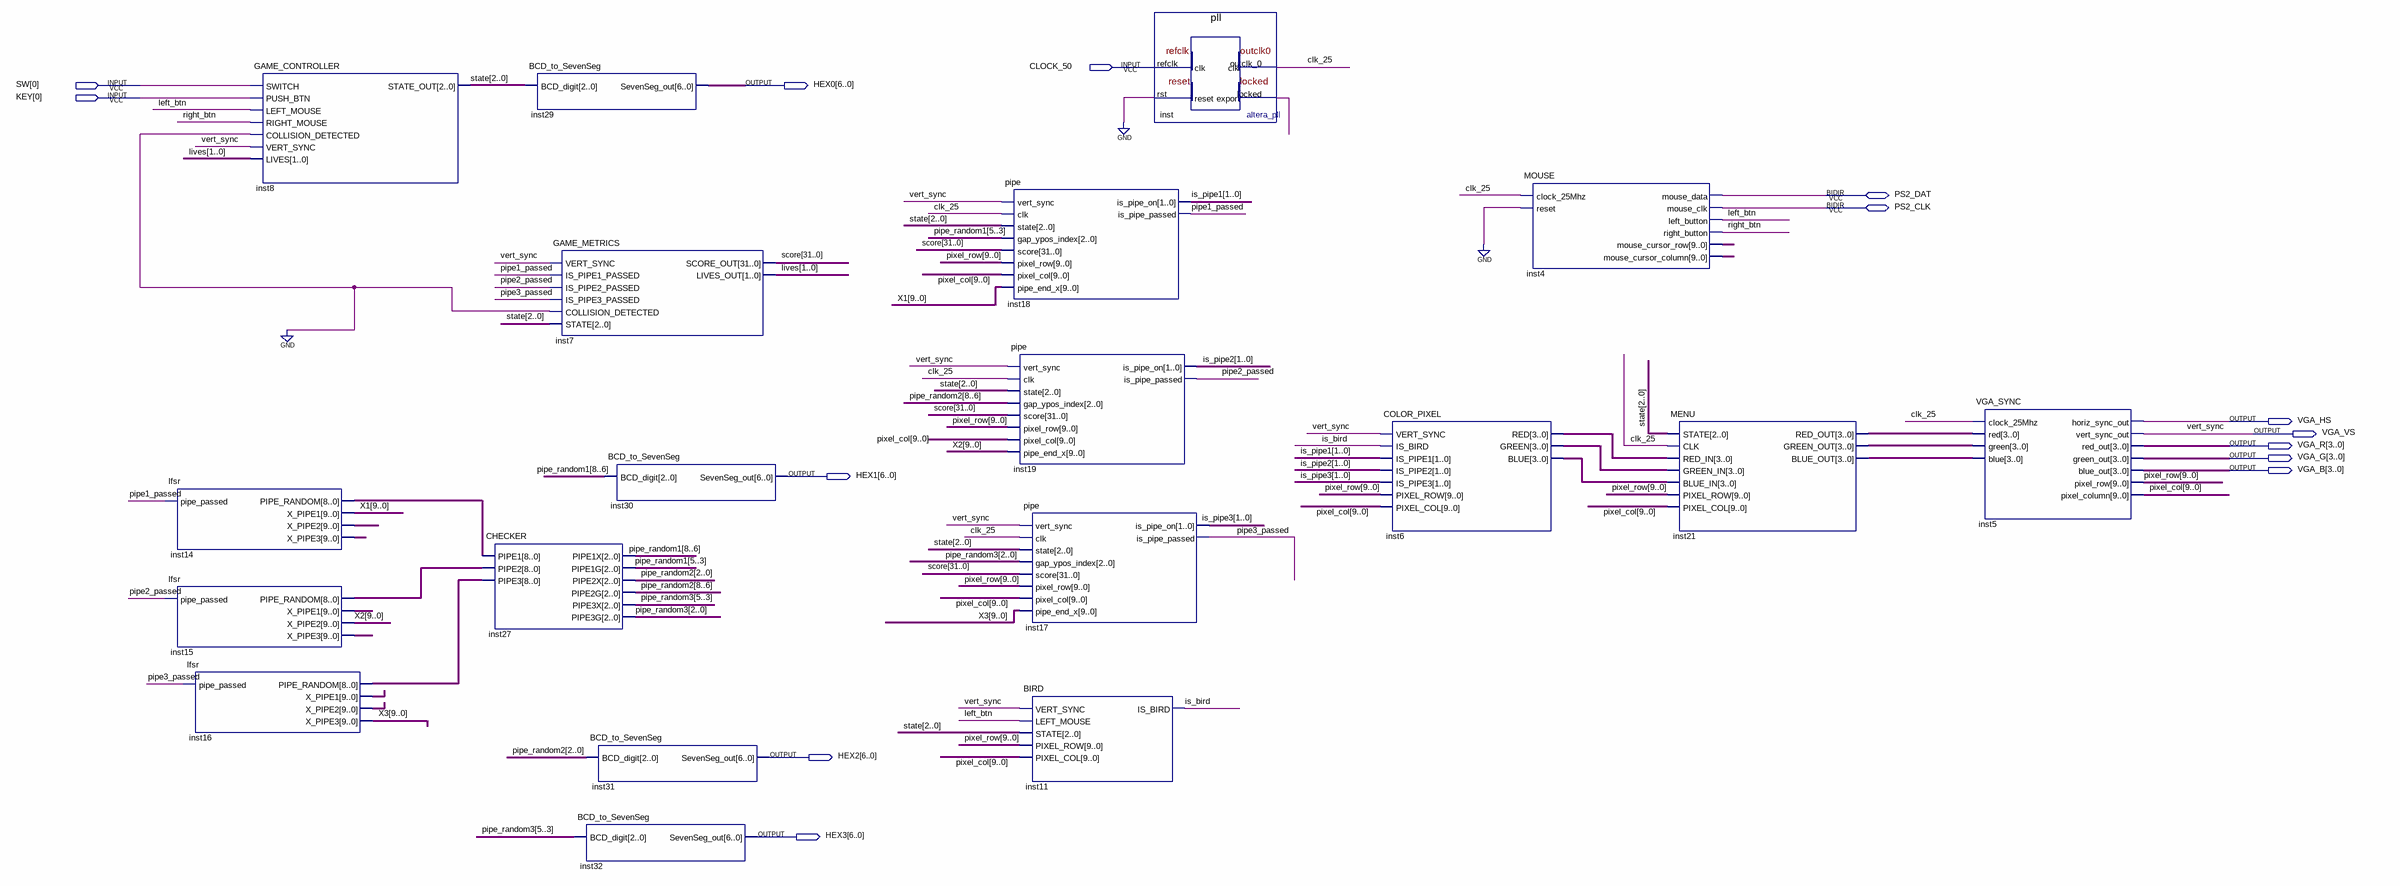
[diagram p0: schematic sheet]
// Quartus schematic flappy_birdv2.bdf as structural Verilog: 19 symbols, 14 pins
module flappy_birdv2 (
  input  CLOCK_50,
  input  [0:0] SW,
  input  [0:0] KEY,
  inout  PS2_DAT,
  inout  PS2_CLK,
  output [6:0] HEX0,
  output VGA_HS,
  output VGA_VS,
  output [3:0] VGA_R,
  output [3:0] VGA_G,
  output [3:0] VGA_B,
  output [6:0] HEX1,
  output [6:0] HEX2,
  output [6:0] HEX3
);

  wire clk_25, inst_locked, is_bird, left_btn, pipe1_passed, pipe2_passed, pipe3_passed, right_btn;
  wire [1:0] is_pipe1, is_pipe2, is_pipe3, lives;
  wire [2:0] state;
  wire [3:0] inst6_blue, inst6_green, inst6_red, inst21_blue_out, inst21_green_out, inst21_red_out;
  wire [5:0] pipe_random3;
  wire [8:0] inst14_pipe_random, inst15_pipe_random, inst16_pipe_random, pipe_random2;
  wire [8:3] pipe_random1;
  wire [9:0] inst4_mouse_cursor_column, inst4_mouse_cursor_row, inst14_x_pipe2, inst14_x_pipe3,
       inst15_x_pipe1, inst15_x_pipe3, inst16_x_pipe1, inst16_x_pipe2, pixel_col, pixel_row, X1, X2, X3;
  wire [31:0] score;

  lfsr inst14 (
    .pipe_passed(pipe1_passed), .PIPE_RANDOM(inst14_pipe_random), .X_PIPE1(X1), .X_PIPE2(inst14_x_pipe2),
    .X_PIPE3(inst14_x_pipe3));
  lfsr inst15 (
    .pipe_passed(pipe2_passed), .PIPE_RANDOM(inst15_pipe_random), .X_PIPE1(inst15_x_pipe1), .X_PIPE2(X2),
    .X_PIPE3(inst15_x_pipe3));
  lfsr inst16 (
    .pipe_passed(pipe3_passed), .PIPE_RANDOM(inst16_pipe_random), .X_PIPE1(inst16_x_pipe1),
    .X_PIPE2(inst16_x_pipe2), .X_PIPE3(X3));
  GAME_CONTROLLER inst8 (
    .SWITCH(SW[0]), .PUSH_BTN(KEY[0]), .LEFT_MOUSE(left_btn), .RIGHT_MOUSE(right_btn),
    .COLLISION_DETECTED(1'b0), .VERT_SYNC(VGA_VS), .LIVES(lives), .STATE_OUT(state));
  CHECKER inst27 (
    .PIPE1(inst14_pipe_random), .PIPE2(inst15_pipe_random), .PIPE3(inst16_pipe_random),
    .PIPE1X(pipe_random1[8:6]), .PIPE1G(pipe_random1[5:3]), .PIPE2X(pipe_random2[2:0]),
    .PIPE2G(pipe_random2[8:6]), .PIPE3X(pipe_random3[5:3]), .PIPE3G(pipe_random3[2:0]));
  BCD_to_SevenSeg inst29 (.BCD_digit(state), .SevenSeg_out(HEX0));
  GAME_METRICS inst7 (
    .VERT_SYNC(VGA_VS), .IS_PIPE1_PASSED(pipe1_passed), .IS_PIPE2_PASSED(pipe2_passed),
    .IS_PIPE3_PASSED(pipe3_passed), .COLLISION_DETECTED(1'b0), .STATE(state), .SCORE_OUT(score),
    .LIVES_OUT(lives));
  BCD_to_SevenSeg inst30 (.BCD_digit(pipe_random1[8:6]), .SevenSeg_out(HEX1));
  BCD_to_SevenSeg inst31 (.BCD_digit(pipe_random2[2:0]), .SevenSeg_out(HEX2));
  BCD_to_SevenSeg inst32 (.BCD_digit(pipe_random3[5:3]), .SevenSeg_out(HEX3));
  pipe inst18 (
    .vert_sync(VGA_VS), .clk(clk_25), .state(state), .gap_ypos_index(pipe_random1[5:3]), .score(score),
    .pixel_row(pixel_row), .pixel_col(pixel_col), .pipe_end_x(X1), .is_pipe_on(is_pipe1),
    .is_pipe_passed(pipe1_passed));
  pipe inst19 (
    .vert_sync(VGA_VS), .clk(clk_25), .state(state), .gap_ypos_index(pipe_random2[8:6]), .score(score),
    .pixel_row(pixel_row), .pixel_col(pixel_col), .pipe_end_x(X2), .is_pipe_on(is_pipe2),
    .is_pipe_passed(pipe2_passed));
  pipe inst17 (
    .vert_sync(VGA_VS), .clk(clk_25), .state(state), .gap_ypos_index(pipe_random3[2:0]), .score(score),
    .pixel_row(pixel_row), .pixel_col(pixel_col), .pipe_end_x(X3), .is_pipe_on(is_pipe3),
    .is_pipe_passed(pipe3_passed));
  BIRD inst11 (
    .VERT_SYNC(VGA_VS), .LEFT_MOUSE(left_btn), .STATE(state), .PIXEL_ROW(pixel_row), .PIXEL_COL(pixel_col),
    .IS_BIRD(is_bird));
  pll inst (.refclk(CLOCK_50), .rst(1'b0), .outclk_0(clk_25), .locked(inst_locked));
  COLOR_PIXEL inst6 (
    .VERT_SYNC(VGA_VS), .IS_BIRD(is_bird), .IS_PIPE1(is_pipe1), .IS_PIPE2(is_pipe2), .IS_PIPE3(is_pipe3),
    .PIXEL_ROW(pixel_row), .PIXEL_COL(pixel_col), .RED(inst6_red), .GREEN(inst6_green), .BLUE(inst6_blue));
  MOUSE inst4 (
    .clock_25Mhz(clk_25), .reset(1'b0), .left_button(left_btn), .right_button(right_btn),
    .mouse_cursor_row(inst4_mouse_cursor_row), .mouse_cursor_column(inst4_mouse_cursor_column),
    .mouse_data(PS2_DAT), .mouse_clk(PS2_CLK));
  MENU inst21 (
    .STATE(state), .CLK(clk_25), .RED_IN(inst6_red), .GREEN_IN(inst6_green), .BLUE_IN(inst6_blue),
    .PIXEL_ROW(pixel_row), .PIXEL_COL(pixel_col), .RED_OUT(inst21_red_out), .GREEN_OUT(inst21_green_out),
    .BLUE_OUT(inst21_blue_out));
  VGA_SYNC inst5 (
    .clock_25Mhz(clk_25), .red(inst21_red_out), .green(inst21_green_out), .blue(inst21_blue_out),
    .horiz_sync_out(VGA_HS), .vert_sync_out(VGA_VS), .red_out(VGA_R), .green_out(VGA_G), .blue_out(VGA_B),
    .pixel_row(pixel_row), .pixel_column(pixel_col));

  // Other names for the same wires on the sheet: vert_sync = VGA_VS
endmodule
